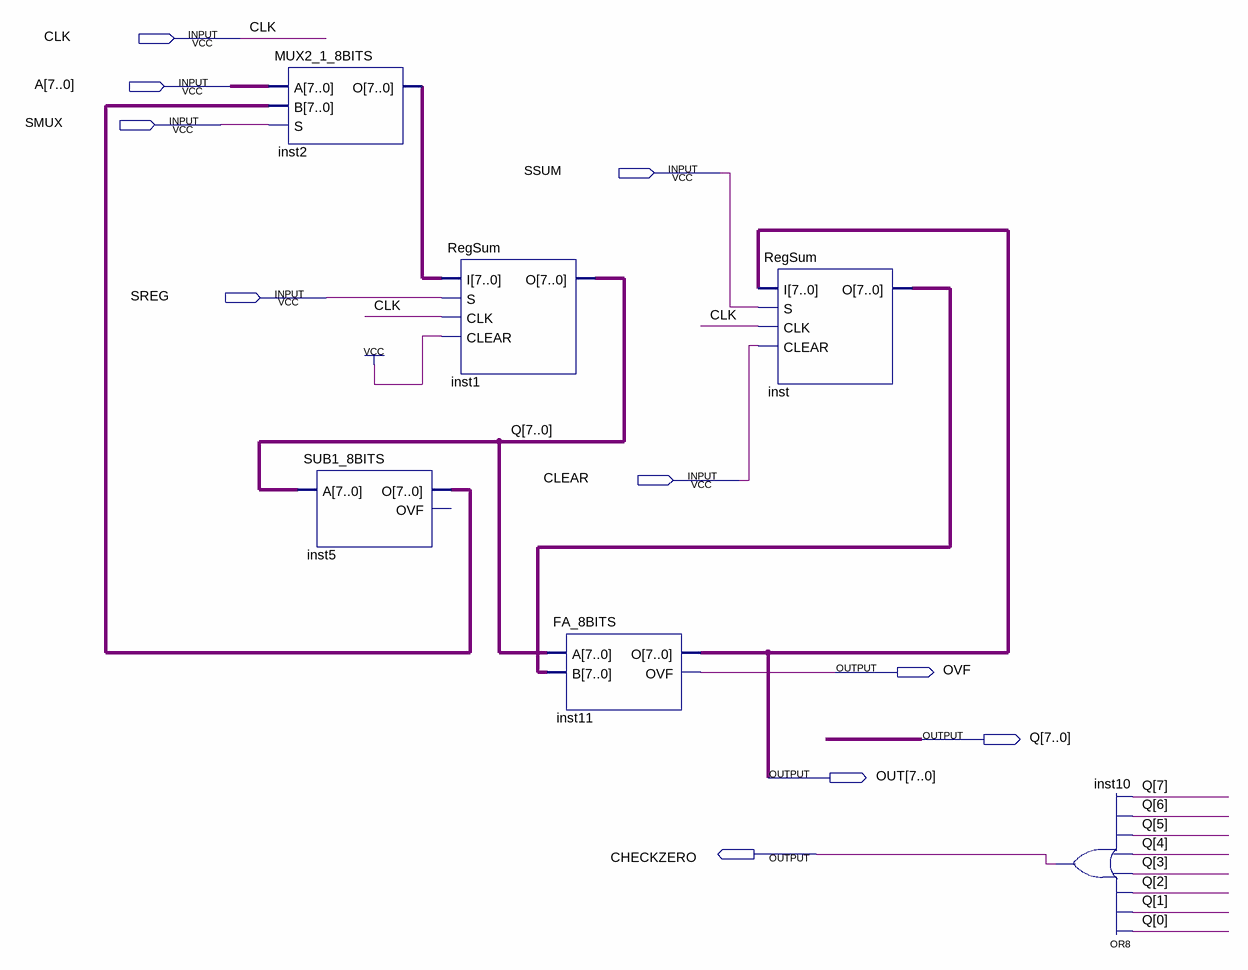
[diagram p0: schematic sheet]
// Quartus schematic DATAPATH.bdf as structural Verilog: 6 symbols, 10 pins
module DATAPATH (
  input  CLK,
  input  [7:0] A,
  input  SMUX,
  input  SSUM,
  input  SREG,
  input  CLEAR,
  output OVF,
  output [7:0] Q,
  output [7:0] OUT,
  output CHECKZERO
);

  wire [7:0] inst2_o, inst5_o, inst_o;

  MUX2_1_8BITS inst2 (.A(A), .B(inst5_o), .S(SMUX), .O(inst2_o));
  SUB1_8BITS inst5 (.A(Q), .O(inst5_o));  // open: OVF
  RegSum inst1 (.I(inst2_o), .S(SREG), .CLK(CLK), .CLEAR(1'b1), .O(Q));
  FA_8BITS inst11 (.A(Q), .B(inst_o), .O(OUT), .OVF(OVF));
  RegSum inst (.I(OUT), .S(SSUM), .CLK(CLK), .CLEAR(CLEAR), .O(inst_o));
  or inst10 (CHECKZERO, Q[0], Q[1], Q[2], Q[3], Q[4], Q[5], Q[6], Q[7]);
endmodule
